# EAGLE design ext (EAGLE 7.3.0)
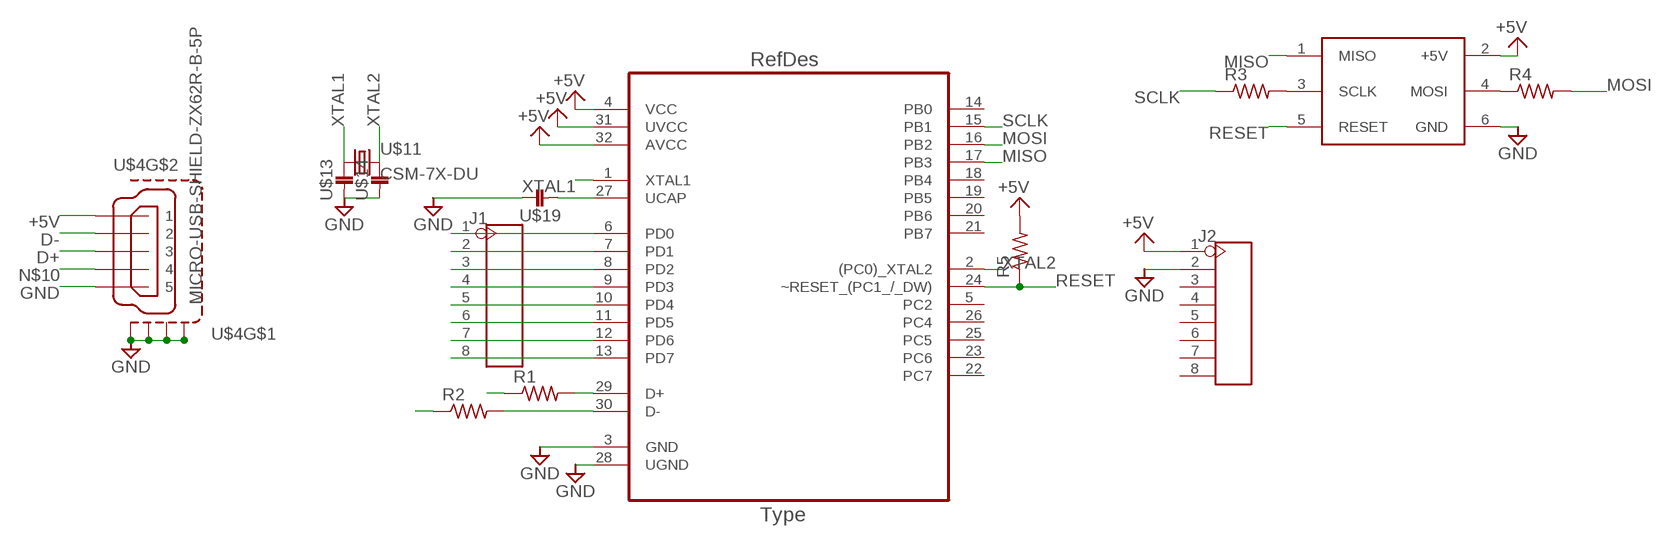
[diagram p0: schematic, sheet 1]

## Parts
J1  HEADER-8P-2.54  [8P-2.54]
J2  HEADER-8P-2.54  [8P-2.54]
R1  R-US_0204/7  [0204/7]
R2  R-US_0204/7  [0204/7]
R3  R-US_0204/5  [0204/5]
R4  R-US_0204/5  [0204/5]
R5  R-US_0204/7  [0204/7]
U1  ATMEGA32U2-AU  [QFP80P900X900X120-32N]
U$4  MICRO-USB-SHIELD-ZX62R-B-5P  [ZX62R-B-5P]
U$7  ICSP  [ICSP]
U$11  CSM-7X-DU  [CSM-7X-DU]
U$13  1608  [1608]
U$14  1608  [1608]
U$19  1608  [1608]

## Nets
+5V: J2.1 R5.2 U1.4(VCC) U1.31(UVCC) U1.32(AVCC) U$4.1 U$7.2(+5V)
D+: R1.1 U$4.3
D-: R2.1 U$4.2
GND: J2.2 U1.3(GND) U1.28(UGND) U$4.5 U$4.M1(S1) U$4.M2(S2) U$4.M3(S3) U$4.M4(S4) U$7.6(GND) U$13.P$2 U$14.P$2 U$19.P$1
MISO: U1.17(PB3) U$7.1(MISO)
MOSI: R4.2 U1.16(PB2)
N$1: J1.2 U1.7(PD1)
N$2: J1.3 U1.8(PD2)
N$3: J1.4 U1.9(PD3)
N$4: J1.5 U1.10(PD4)
N$5: J1.6 U1.11(PD5)
N$6: J1.7 U1.12(PD6)
N$7: J1.8 U1.13(PD7)
N$8: J1.1 U1.6(PD0)
N$9: R1.2 U1.29(D+)
N$10: U$4.4
N$11: R2.2 U1.30(D-)
N$12: R3.2 U$7.3(SCLK)
N$13: R4.1 U$7.4(MOSI)
N$14: U1.27(UCAP) U$19.P$2
RESET: R5.1 U1.24(~RESET_(PC1_/_DW)) U$7.5(RESET)
SCLK: R3.1 U1.15(PB1)
XTAL1: U1.1(XTAL1) U$11.1 U$13.P$1
XTAL2: U1.2((PC0)_XTAL2) U$11.2 U$14.P$1
Unconnected: J2.3 J2.4 J2.5 J2.6 J2.7 J2.8 U1.5(PC2) U1.14(PB0) U1.18(PB4) U1.19(PB5) U1.20(PB6) U1.21(PB7) U1.22(PC7) U1.23(PC6) U1.25(PC5) U1.26(PC4)

## Library data of the parts
J1 J2 = Connector :HEADER-8P
R1-R5 = resistor:R-US_: RESISTOR, American symbol
U1 = Atmel-ATMEGA32U2-AU:ATMEGA32U2-AU; DESCRIPTION: 8-bit Microcontroller with ISP Flash and USB Controller; MPN: ATMEGA32U2-AU; OC_FARNELL: 1748524; OC_NEWARK: 26R5632; PACKAGE: TQFP-32; SUPPLIER: Atmel
U$4 = con-hirose1:MICRO-USB-SHIELD-: Hirose Micro USB Connector ZX62R-B-5P: Micro B, reverse (top mount) shell SMT Supplier: DigiKey H11574CT-ND Source: http://www.hirose.co.jp/cataloge_hp/e24200011.pdf
U$7 = 08_CONECTOR:ICSP
U$11 = 09_2_CRYSTAL:CSM-7X-DU
U$13 U$14 U$19 = 02_C:1608

## Board
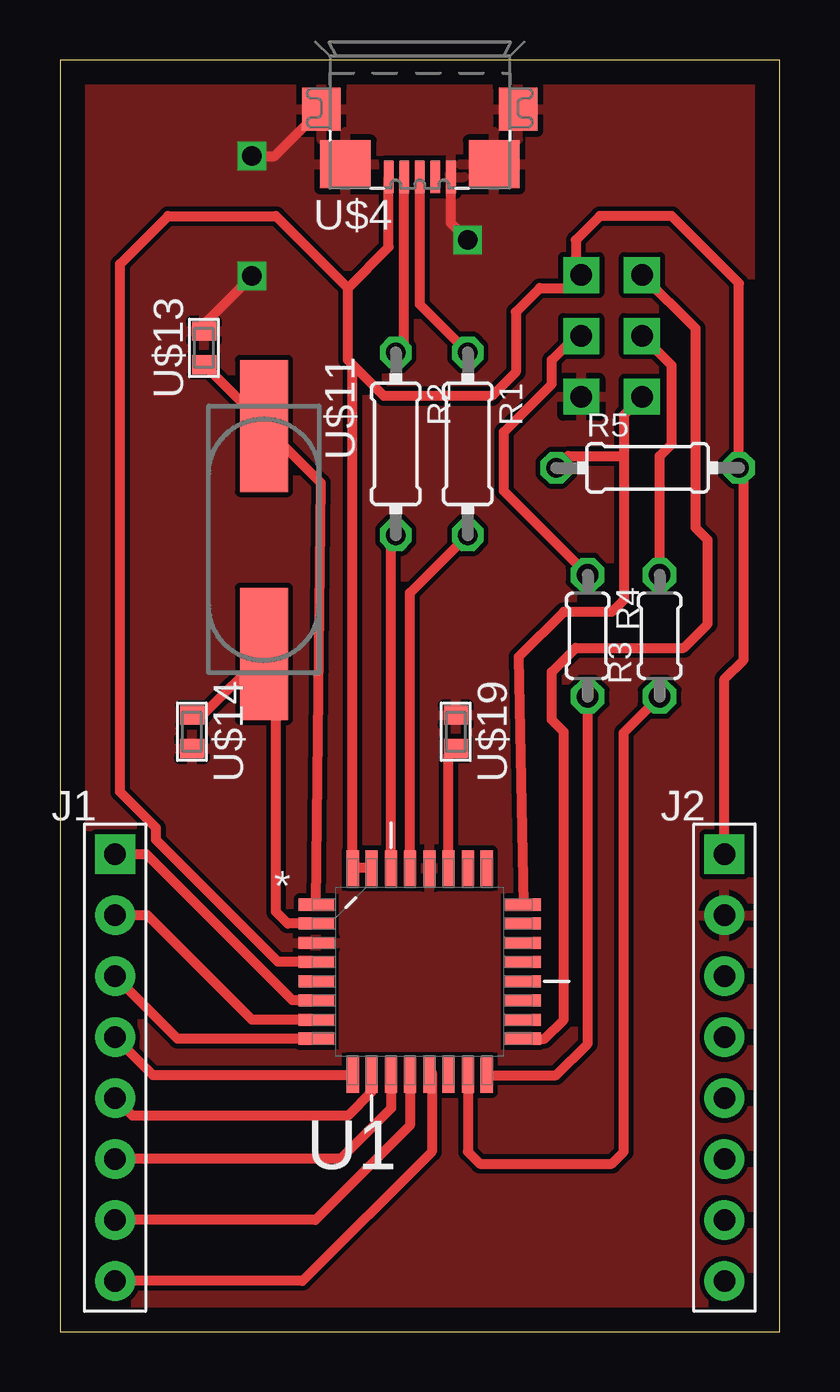
[diagram p1: board, top side]
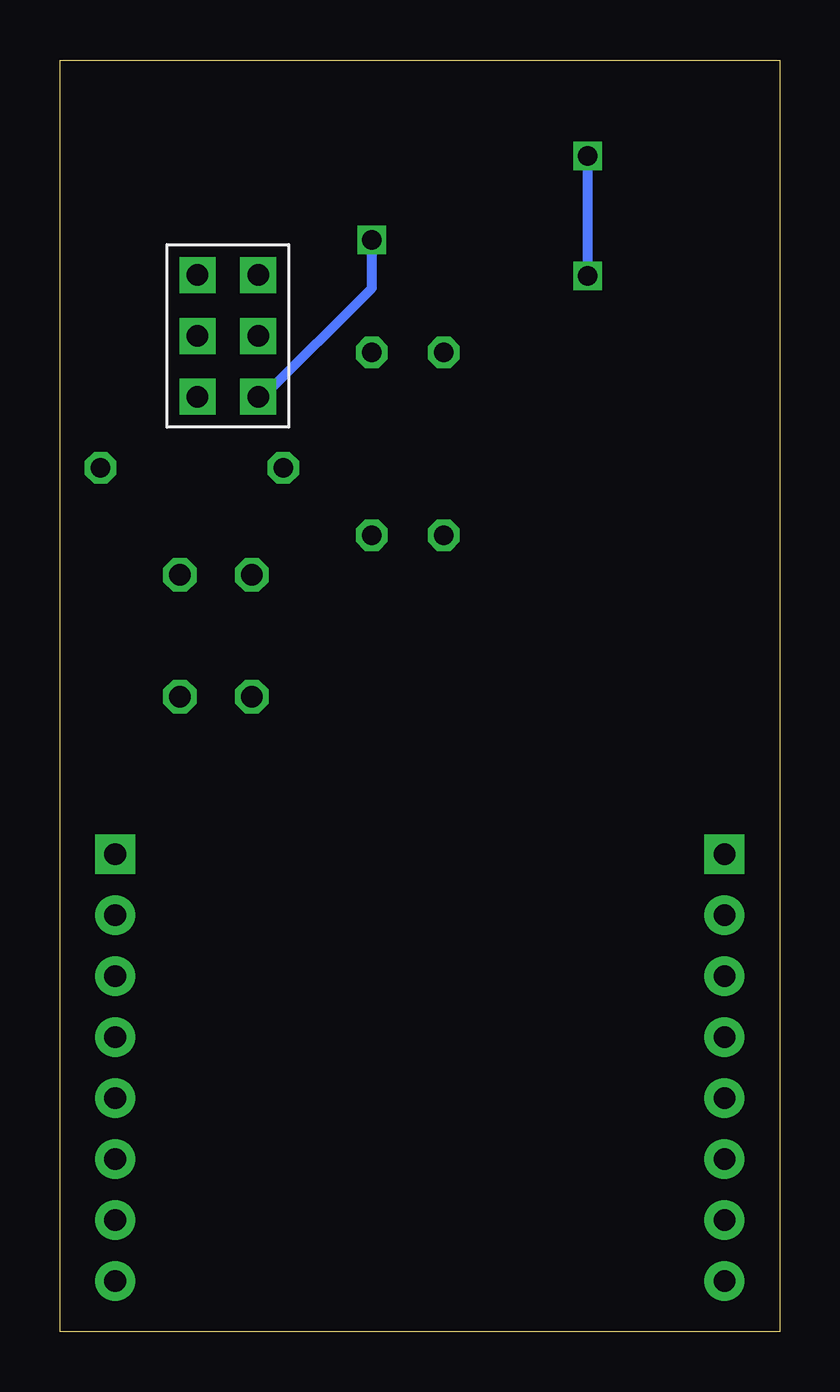
[diagram p2: board, bottom side, seen from below]

Size 30 x 53 mm. Coordinates in mm from the lower left corner, seen from the top.
Outline: 0,0 30,0 30,53 0,53 0,0
Copper layers (1*16): Top 0.035mm / dielectric 1.5mm / Bottom 0.035mm
Design rules "default": minimum track width 10mil, minimum drill 24mil, track to track 8mil, track to pad 8mil, pad to pad 8mil, via to via 8mil, smd to smd 8mil, copper to edge 40mil, drill to drill 8mil, minimum pad ring 10mil, minimum via ring 8mil, stop-mask expansion 4mil, vias tented up to drill 0mil, thermal gap 10mil

### Footprints (pad centres in the part's own frame; a part is rotated, then mirrored left to right if it is on the bottom)
8P-2.54 = drill 0.9 pad 1.651 square: 1 0,8.89 | drill 0.9 pad 1.651: 2 0,6.35; 3 0,3.81; 4 0,1.27; 5 0,-1.27; 6 0,-3.81; 7 0,-6.35; 8 0,-8.89
0204/7 = drill 0.8 octagon: 1 -3.81,0; 2 3.81,0
0204/5 = drill 0.9 octagon: 1 -2.54,0; 2 2.54,0
QFP80P900X900X120-32N = smd 1.473 x 0.508: 1 -4.315,2.794; 2 -4.315,2.007; 3 -4.315,1.194; 4 -4.315,0.406; 5 -4.315,-0.406; 6 -4.315,-1.194; 7 -4.315,-2.007; 8 -4.315,-2.794; 17 4.315,-2.794; 18 4.315,-2.007; 19 4.315,-1.194; 20 4.315,-0.406; 21 4.315,0.406; 22 4.315,1.194; 23 4.315,2.007; 24 4.315,2.794 | smd 0.508 x 1.473: 9 -2.794,-4.315; 10 -2.007,-4.315; 11 -1.194,-4.315; 12 -0.406,-4.315; 13 0.406,-4.315; 14 1.194,-4.315; 15 2.007,-4.315; 16 2.794,-4.315; 25 2.794,4.315; 26 2.007,4.315; 27 1.194,4.315; 28 0.406,4.315; 29 -0.406,4.315; 30 -1.194,4.315; 31 -2.007,4.315; 32 -2.794,4.315
ZX62R-B-5P = smd 1.35 x 0.4: 1 2.875,-1.3; 2 2.875,-0.65; 3 2.875,0; 4 2.875,0.65; 5 2.875,1.3 | smd 1.8 x 1.6: M1 0.05,-4.1; M2 0.05,4.1 | smd 2 x 2.1: M3 2.35,3.1; M4 2.35,-3.1
ICSP = drill 0.9 pad 1.5 square: 1 -1.27,2.54; 2 1.27,2.54; 3 -1.27,0; 4 1.27,0; 5 -1.27,-2.54; 6 1.27,-2.54
CSM-7X-DU = smd 5.5 x 2: 1 -4.75,0; 2 4.75,0
1608 = smd 0.8 x 1: P$1 -0.7,0; P$2 0.7,0

### Placement (x,y rotation side)
J1  2.3,11 0 top
J2  27.7,11 0 top
R1  17,37 270 top
R2  14,37 270 top
R3  25,29 90 top
R4  22,29 270 top
R5  24.5,36 0 top
U1  15,15 0 top
U$4  15,51 270 top
U$7  23,41.5 0 bottom
U$11  8.5,33 270 top
U$13  6,41 90 top
U$14  5.5,25 270 top
U$19  16.5,25 270 top

### Tracks (layer width: path | path; a pad name or v marks a point on that pad's centre or on a via)
+5V
  Top 0.406: J2.1 27.7,27.2 28.5,28 28.5,35.81 R5.2 28.31,43.69 25.5,46.5 22.5,46.5 21.5,45.5 21.5,44.27 | 21.5,44.27 U$7.2 21.19,43.5 20,43.5 19,42.5 19,40 18,39 13.5,39 12.25,40.25 | 21.5,44.27 21.5,44 | 12.25,40.25 12,40.5 12,43.5 | 12,43.5 13.7,45.2 U$4.1 | 12.25,40.25 12.21,40.21 U1.32 U1.31 | U1.4 9.09,15.41 4,20.5 4,21 2.5,22.5 2.5,44.5 4.5,46.5 9,46.5 12,43.5
D+
  Top 0.406: R1.1 15,42.81 U$4.3
D-
  Top 0.406: R2.1 14.35,41.16 U$4.2
GND  (via drill 0.8)
  Top 0.406: v17,45.5 16.3,46.2 U$4.5 | U$13.P$2 6,42 v8,44 | v8,49 8.95,49 U$4.M1
  Bottom 0.406: U$7.6 21.54,38.96 17,43.5 v17,45.5 | v8,44 v8,49
  pour Top: 0,53 30,53 30,0 0,0
MISO
  Top 0.406: U1.17 20.21,12.21 21,13 21,25 20.5,25.5 20.5,27.5 21.5,28.5 26,28.5 27,29.5 27,33 26.5,33.5 26.5,41.81 U$7.1
MOSI
  Top 0.406: U1.16 20.68,10.69 22,12 R4.2
N$1
  Top 0.406: U1.7 8.01,12.99 3.65,17.35 J1.2
N$2
  Top 0.406: U1.8 4.9,12.21 J1.3
N$3
  Top 0.406: U1.9 3.88,10.69 J1.4
N$4
  Top 0.406: U1.10 12.99,9.99 12,9 3.03,9 J1.5
N$5
  Top 0.406: U1.11 13.81,9.31 11.69,7.19 J1.6
N$6
  Top 0.406: U1.12 14.59,8.59 10.65,4.65 J1.7
N$7
  Top 0.406: U1.13 15.5,10.79 15.5,7.5 10.11,2.11 J1.8
N$8
  Top 0.406: U1.6 9.69,13.81 3.61,19.89 J1.1
N$9
  Top 0.406: U1.29 14.59,30.78 R1.2
N$11
  Top 0.406: U1.30 13.81,33 R2.2
N$12
  Top 0.406: R3.2 25,36.5 25.5,37 25.5,40.27 U$7.3
N$13
  Top 0.406: U$7.4 21.5,41.5 20.5,40.5 20.5,39.5 18.5,37.5 18.5,35.04 R4.1
N$14
  Top 0.406: U1.27 16.19,23.99 U$19.P$2
RESET
  Top 0.406: U$7.5 23.5,38.19 23.5,36.5 | 23.5,36.5 23.5,30.5 23,30 21,30 19.11,28.11 U1.24 | R5.1 21.19,36.5 23.5,36.5
SCLK
  Top 0.406: U1.15 17.01,7.49 17.5,7 23,7 23.5,7.5 23.5,24.96 R3.1
XTAL1
  Top 0.406: U$13.P$1 8.5,37.8 U$11.1 10.88,35.37 U1.1
XTAL2
  Top 0.406: U$14.P$1 5.95,25.7 U$11.2 8.5,29 9,28.5 9,17.5 9.49,17.01 U1.2